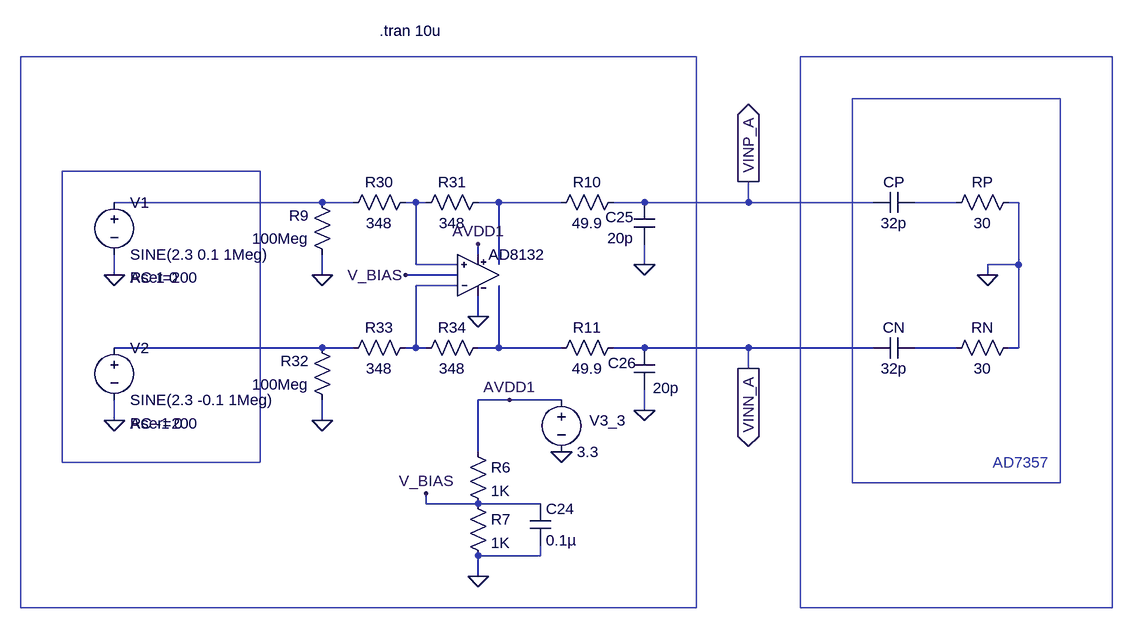
[diagram p0: schematic AD-AD8132.asc]
AD-AD8132.asc, the LTspice schematic file:
Version 4
SHEET 1 1456 680
WIRE -64 48 -384 48
WIRE -16 48 -64 48
WIRE 80 48 64 48
WIRE 96 48 80 48
WIRE 208 48 176 48
WIRE 304 48 208 48
WIRE 432 48 384 48
WIRE 592 48 592 16
WIRE 592 48 432 48
WIRE 784 48 592 48
WIRE 912 48 848 48
WIRE 1008 48 992 48
WIRE 176 128 176 112
WIRE 80 144 80 48
WIRE 144 144 80 144
WIRE 208 144 208 48
WIRE 432 144 432 112
WIRE 1008 144 1008 48
WIRE 1008 144 960 144
WIRE -384 160 -384 128
WIRE -64 160 -64 128
WIRE 144 160 64 160
WIRE 960 160 960 144
WIRE 144 176 80 176
WIRE 176 224 176 192
WIRE -64 272 -384 272
WIRE -16 272 -64 272
WIRE 80 272 80 176
WIRE 80 272 64 272
WIRE 96 272 80 272
WIRE 208 272 208 176
WIRE 208 272 176 272
WIRE 304 272 208 272
WIRE 432 272 384 272
WIRE 592 272 432 272
WIRE 784 272 592 272
WIRE 912 272 848 272
WIRE 1008 272 1008 144
WIRE 1008 272 992 272
WIRE 592 304 592 272
WIRE 224 352 176 352
WIRE 304 352 224 352
WIRE 432 368 432 336
WIRE -384 384 -384 352
WIRE -64 384 -64 352
WIRE 176 432 176 352
WIRE 96 512 96 496
WIRE 176 512 96 512
WIRE 272 512 176 512
WIRE 272 592 272 576
WIRE 272 592 176 592
WIRE 176 624 176 592
FLAG -64 160 0
FLAG -64 384 0
FLAG 432 144 0
FLAG 432 368 0
FLAG 592 304 VINN_A
IOPIN 592 304 Out
FLAG 592 16 VINP_A
IOPIN 592 16 Out
FLAG -384 160 0
FLAG 224 352 AVDD1
FLAG 304 432 0
FLAG 176 112 AVDD1
FLAG 176 224 0
FLAG 176 624 0
FLAG 96 496 V_BIAS
FLAG 64 160 V_BIAS
FLAG 960 160 0
FLAG -384 384 0
SYMBOL res 80 256 R90
WINDOW 0 0 56 VBottom 0
WINDOW 3 32 56 VTop 0
SYMATTR InstName R33
SYMATTR Value 348
SYMATTR SpiceLine tol=1 pwr=0.1
SYMBOL res 80 32 R90
WINDOW 0 0 56 VBottom 0
WINDOW 3 32 56 VTop 0
SYMATTR InstName R30
SYMATTR Value 348
SYMATTR SpiceLine tol=1 pwr=0.1
SYMBOL res -48 368 R180
WINDOW 0 36 76 Left 0
WINDOW 3 36 40 Left 0
SYMATTR InstName R32
SYMATTR Value 100Meg
SYMATTR SpiceLine tol=1 pwr=0.1
SYMBOL res -48 144 R180
WINDOW 0 36 76 Left 0
WINDOW 3 36 40 Left 0
SYMATTR InstName R9
SYMATTR Value 100Meg
SYMATTR SpiceLine tol=1 pwr=0.1
SYMBOL res 400 256 R90
WINDOW 0 0 56 VBottom 0
WINDOW 3 32 56 VTop 0
SYMATTR InstName R11
SYMATTR Value 49.9
SYMATTR SpiceLine tol=1 pwr=0.1
SYMBOL res 192 256 R90
WINDOW 0 0 56 VBottom 0
WINDOW 3 32 56 VTop 0
SYMATTR InstName R34
SYMATTR Value 348
SYMATTR SpiceLine tol=1 pwr=0.1
SYMBOL res 192 32 R90
WINDOW 0 0 56 VBottom 0
WINDOW 3 32 56 VTop 0
SYMATTR InstName R31
SYMATTR Value 348
SYMATTR SpiceLine tol=1 pwr=0.1
SYMBOL res 400 32 R90
WINDOW 0 0 56 VBottom 0
WINDOW 3 32 56 VTop 0
SYMATTR InstName R10
SYMATTR Value 49.9
SYMATTR SpiceLine tol=1 pwr=0.1
SYMBOL cap 416 272 R0
WINDOW 0 -40 23 Left 0
WINDOW 3 29 62 Left 0
SYMATTR InstName C26
SYMATTR Value 20p
SYMBOL cap 416 48 R0
WINDOW 0 -44 23 Left 0
WINDOW 3 -41 55 Left 0
SYMATTR InstName C25
SYMATTR Value 20p
SYMBOL cap 848 32 R90
WINDOW 0 0 32 VBottom 0
WINDOW 3 32 32 VTop 0
SYMATTR InstName CP
SYMATTR Value 32p
SYMBOL res 896 288 R270
WINDOW 0 32 56 VTop 0
WINDOW 3 0 56 VBottom 0
SYMATTR InstName RN
SYMATTR Value 30
SYMATTR SpiceLine tol=1 pwr=0.1
SYMBOL cap 848 256 R90
WINDOW 0 0 32 VBottom 0
WINDOW 3 32 32 VTop 0
SYMATTR InstName CN
SYMATTR Value 32p
SYMBOL voltage -384 32 R0
WINDOW 123 24 132 Left 0
WINDOW 39 24 132 Left 0
SYMATTR Value2 AC 1 0
SYMATTR SpiceLine Rser=200
SYMATTR InstName V1
SYMATTR Value SINE(2.3 0.1 1Meg)
SYMBOL voltage 304 336 R0
WINDOW 123 0 0 Left 0
WINDOW 39 0 0 Left 0
WINDOW 0 43 48 Left 0
SYMATTR InstName V3_3
SYMATTR Value 3.3
SYMBOL ad8132 176 160 R0
SYMATTR InstName AD8132
SYMBOL res 160 416 R0
SYMATTR InstName R6
SYMATTR Value 1K
SYMATTR SpiceLine tol=1 pwr=0.1
SYMBOL res 160 496 R0
SYMATTR InstName R7
SYMATTR Value 1K
SYMATTR SpiceLine tol=1 pwr=0.1
SYMBOL cap 256 512 R0
SYMATTR InstName C24
SYMATTR Value 0.1µ
SYMBOL res 1008 32 R90
WINDOW 0 0 56 VBottom 0
WINDOW 3 32 56 VTop 0
SYMATTR InstName RP
SYMATTR Value 30
SYMBOL voltage -384 256 R0
WINDOW 123 24 132 Left 0
WINDOW 39 24 132 Left 0
SYMATTR Value2 AC -1 0
SYMATTR SpiceLine Rser=200
SYMATTR InstName V2
SYMATTR Value SINE(2.3 -0.1 1Meg)
TEXT 24 -216 Left 0 !.tran 10u
TEXT 968 448 Left 0 ;AD7357
RECTANGLE Normal 752 480 1072 -112
RECTANGLE Normal -464 448 -160 0
RECTANGLE Normal -528 672 512 -176
RECTANGLE Normal 1152 672 672 -176

The netlist it stands for:
* AD-AD8132.asc
R33 N005 N006 348 tol=1 pwr=0.1
R30 N002 N001 348 tol=1 pwr=0.1
R32 0 N006 100Meg tol=1 pwr=0.1
R9 0 N001 100Meg tol=1 pwr=0.1
R11 VINN_A N007 49.9 tol=1 pwr=0.1
R34 N007 N005 348 tol=1 pwr=0.1
R31 N003 N002 348 tol=1 pwr=0.1
R10 VINP_A N003 49.9 tol=1 pwr=0.1
C26 VINN_A 0 20p
C25 VINP_A 0 20p
CP N004 VINP_A 32p
RN N008 0 30 tol=1 pwr=0.1
CN N008 VINN_A 32p
V1 N001 0 SINE(2.3 0.1 1Meg) AC 1 0 Rser=200
V3_3 AVDD1 0 3.3
XAD8132 N002 N005 AVDD1 0 N003 N007 V_BIAS AD8132  ; pins In+ In- V+ V- OUT- OUT+ VOCM
R6 AVDD1 V_BIAS 1K tol=1 pwr=0.1
R7 V_BIAS 0 1K tol=1 pwr=0.1
C24 V_BIAS 0 0.1µ
RP 0 N004 30
V2 N006 0 SINE(2.3 -0.1 1Meg) AC -1 0 Rser=200
.tran 10u
* AD7357
.lib ad8132.cir
.backanno
.end